# EAGLE schematic Dongle_charger (EAGLE 9.6.2)
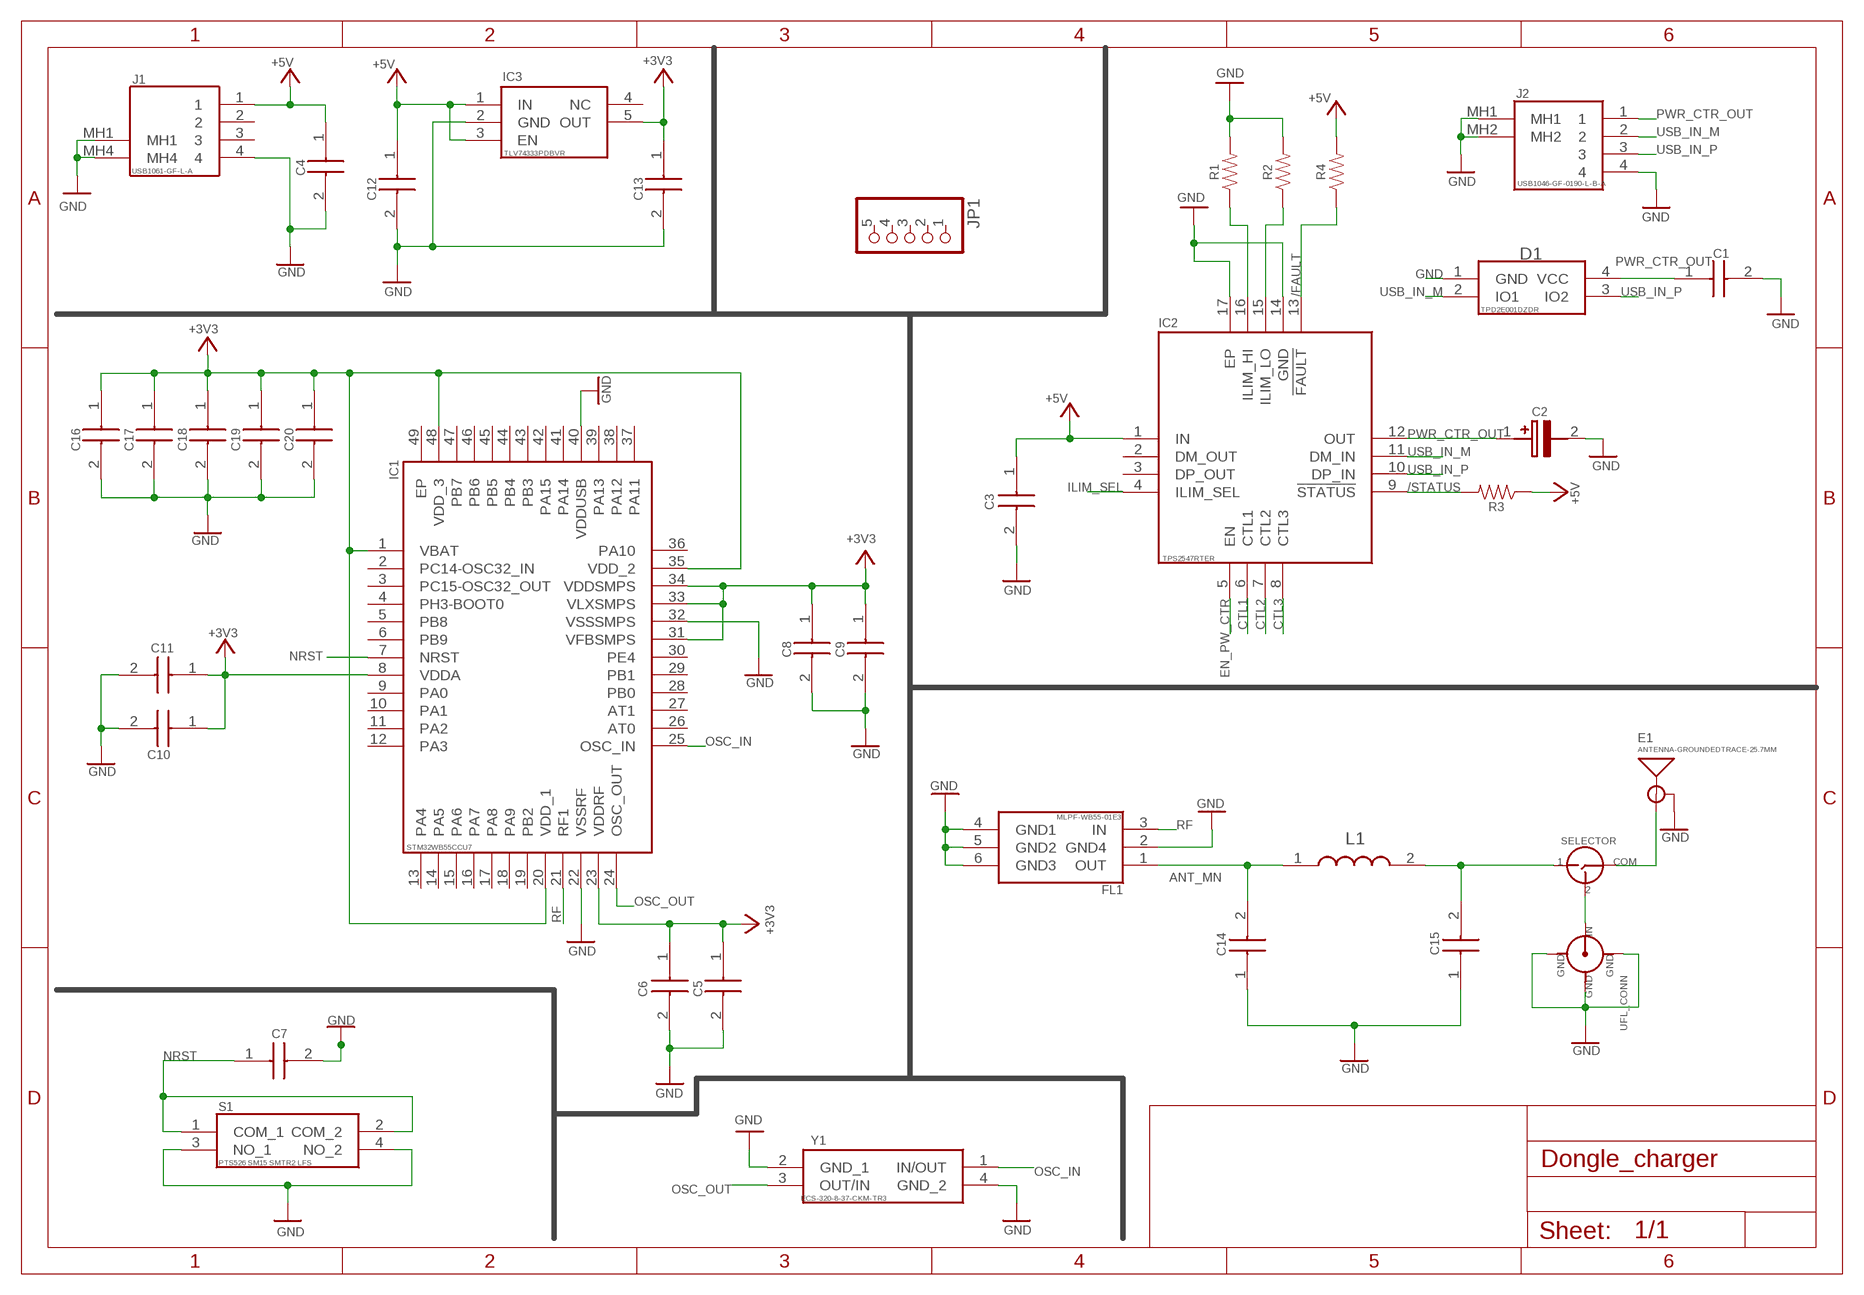
[diagram p0: schematic, sheet 1]

## Parts
C1  0.1u  C0603C104K5RAC7867  [CAPC1608X95N]
C2  150u  TPSD157K010R0100  [CAPPM7344X310N]
C3  0.1u  C0603C104K5RAC7867  [CAPC1608X95N]
C4  10u  CL21A106KOQNNNE  [CAPC2012X140N]
C5  100p  885012205055  [CAPC1005X55N]
C6  100n  LMF105B7104MVHF  [CAPPC1005X55N]
C7  C0603C104K5RAC7867  [CAPC1608X95N]
C8  4.7u  GRT188R6YA475KE13J  [CAPC1608X90N]
C9  0.1u  C0603C104K5RAC7867  [CAPC1608X95N]
C10  10n  C1608X5R1H103K080AA  [CAPC1608X80N]
C11  1u  CL10A105KA8NNNC  [CAPC1608X90N]
C12  1u  C0603C105K3PAC  [CAPC1608X95N]
C13  1u  C0603C105K3PAC  [CAPC1608X95N]
C14  GCM1555G1H1R0CA16D  [CAPC1005X55N]
C15  GCM1555G1H1R0CA16D  [CAPC1005X55N]
C16  4.7u  GRT188R6YA475KE13J  [CAPC1608X90N]
C17  0.1u  C0603C104K5RAC7867  [CAPC1608X95N]
C18  0.1u  C0603C104K5RAC7867  [CAPC1608X95N]
C19  0.1u  C0603C104K5RAC7867  [CAPC1608X95N]
C20  0.1u  C0603C104K5RAC7867  [CAPC1608X95N]
D1  TPD2E001DZDR  [TPD2E001DZDR]
E1  ANTENNA-GROUNDEDTRACE-25.7MM  [TRACE_ANTENNA_2.4GHZ_25.7MM]
FL1  MLPF-WB55-01E3  [MLPFWB5501E3]
IC1  STM32WB55CCU7  [QFN50P700X700X65-49N]
IC2  TPS2547RTER  [QFN50P300X300X80-17N]
IC3  TLV74333PDBVR  [SOT95P280X145-5N]
J1  USB1061-GF-L-A  [USB1061GFLA]
J2  USB1046-GF-0190-L-B-A  [USB1046GF0190LBA]
JP1  PINHD-1X5  [1X05]
L1  ATFC-0402-2N5-BT  [INDC1005X37N]
R1  16.9K  1.8MOHM  [0603]
R2  80.6K  1.8MOHM  [0603]
R3  80.6K  1.8MOHM  [0603]
R4  80.6K  1.8MOHM  [0603]
S1  PTS526_SM15_SMTR2_LFS  [PTS526SM15SMTR2LFS]
SEL1  3_PIN_RES  [3_PAD_RES]
UFL1  UFL_CONNECTOR  [UFL_CONNECTOR]
Y1  ECS-320-8-37-CKM-TR3  [ECS320837CKMTR3]

## Nets
+3V3: C5.1 C6.1(+) C8.1 C9.1 C10.1 C11.1 C13.1 C16.1 C17.1 C18.1 C19.1 C20.1 IC1.1(VBAT) IC1.8(VDDA) IC1.20(VDD_1) IC1.23(VDDRF) IC1.31(VFBSMPS) IC1.33(VLXSMPS) IC1.34(VDDSMPS) IC1.35(VDD_2) IC1.48(VDD_3) IC3.5(OUT)
+5V: C3.1 C4.1 C12.1 IC2.1(IN) IC3.1(IN) IC3.3(EN) J1.1 R3.1 R4.2
/FAULT: IC2.13(!FAULT) R4.1
/STATUS: IC2.9(!STATUS) R3.2
ANT_MN: C14.2 FL1.1(OUT) L1.1
CTL1: IC2.6(CTL1)
CTL2: IC2.7(CTL2)
CTL3: IC2.8(CTL3)
EN_PW_CTR: IC2.5(EN)
GND: C1.2 C2.2(-) C3.2 C4.2 C5.2 C6.2(-) C7.2 C8.2 C9.2 C10.2 C11.2 C12.2 C13.2 C14.1 C15.1 C16.2 C17.2 C18.2 C19.2 C20.2 D1.1(GND) E1.GND E1.GND2(GND) FL1.2(GND4) FL1.4(GND1) FL1.5(GND2) FL1.6(GND3) IC1.22(VSSRF) IC1.32(VSSSMPS) IC1.40(VDDUSB) IC2.14(GND) IC2.17(EP) IC3.2(GND) J1.4 J1.MH1 J1.MH4 J2.4 J2.MH1 J2.MH2 R1.2 R2.2 S1.3(NO_1) S1.4(NO_2) UFL1.1 UFL1.2 UFL1.3 Y1.2(GND_1) Y1.4(GND_2)
ILIM_SEL: IC2.4(ILIM_SEL)
N$1: E1.ANT(SIGNAL) SEL1.COM
N$2: C15.2 L1.2 SEL1.1
N$4: IC2.16(ILIM_HI) R1.1
N$5: IC2.15(ILIM_LO) R2.1
N$7: SEL1.2 UFL1.IN
NRST: C7.1 IC1.7(NRST) S1.1(COM_1) S1.2(COM_2)
OSC_IN: IC1.25(OSC_IN) Y1.1(IN/OUT)
OSC_OUT: IC1.24(OSC_OUT) Y1.3(OUT/IN)
PWR_CTR_OUT: C1.1 C2.1(+) D1.4(VCC) IC2.12(OUT) J2.1
RF: FL1.3(IN) IC1.21(RF1)
USB_IN_M: D1.2(IO1) IC2.11(DM_IN) J2.2
USB_IN_P: D1.3(IO2) IC2.10(DP_IN) J2.3
Unconnected: IC1.2(PC14-OSC32_IN) IC1.3(PC15-OSC32_OUT) IC1.4(PH3-BOOT0) IC1.5(PB8) IC1.6(PB9) IC1.9(PA0) IC1.10(PA1) IC1.11(PA2) IC1.12(PA3) IC1.13(PA4) IC1.14(PA5) IC1.15(PA6) IC1.16(PA7) IC1.17(PA8) IC1.18(PA9) IC1.19(PB2) IC1.26(AT0) IC1.27(AT1) IC1.28(PB0) IC1.29(PB1) IC1.30(PE4) IC1.36(PA10) IC1.37(PA11) IC1.38(PA12) IC1.39(PA13) IC1.41(PA14) IC1.42(PA15) IC1.43(PB3) IC1.44(PB4) IC1.45(PB5) IC1.46(PB6) IC1.47(PB7) IC1.49(EP) IC2.2(DM_OUT) IC2.3(DP_OUT) IC3.4(NC) J1.2 J1.3 JP1.1 JP1.2 JP1.3 JP1.4 JP1.5

## Library data of the parts
C1 C3 C7 C9 C17-C20 = SamacSys_Parts:C0603C104K5RAC7867: Multilayer Ceramic Capacitors MLCC - SMD/SMT 50V 0.1uF X7R 0603 10% Source: Datasheet <https://www.kemet.com/specsheet/C0603C104K5RACTUhttps://www.kemet.com/specsheet/C0603C104K5RACTU>; DESCRIPTION: Multilayer Ceramic Capacitors MLCC - SMD/SMT 50V 0.1uF X7R 0603 10%; HEIGHT: 0.95mm; MANUFACTURER_NAME: KEMET; MANUFACTURER_PART_NUMBER: C0603C104K5RAC7867; MOUSER_PART_NUMBER: 80-C0603C104K5R7867; MOUSER_PRICE-STOCK: https://www.mouser.co.uk/ProductDetail/KEMET/C0603C104K5RAC7867?qs=xVzHhAug4FAw3onBjqyf%252BQ%3D%3D
C2 = SamacSys_Parts:TPSD157K010R0100: AVX - TPSD157K010R0100 - Surface Mount Tantalum Capacitor, 150 F, 10 V, 2917 [7343 Metric], TPS Series, +/- 10%, -55 C Source: Datasheet <https://componentsearchengine.com/Datasheets/2/TPSD157K010R0100.pdf>; DESCRIPTION: AVX - TPSD157K010R0100 - Surface Mount Tantalum Capacitor, 150 F, 10 V, 2917 [7343 Metric], TPS Series, +/- 10%, -55 C; HEIGHT: 3.1mm; MANUFACTURER_NAME: AVX; MANUFACTURER_PART_NUMBER: TPSD157K010R0100
C4 = SamacSys_Parts:CL21A106KOQNNNE: Samsung Electro-Mechanics 0805 (2012M) 10uF MLCC 16V dc +/-10% SMD CL21A106KOQNNNE Source: Datasheet <https://datasheet.datasheetarchive.com/originals/distributors/Datasheets_SAMA/0289c6d4f30f89b64e7dd5b6a9ee99f0.pdf>; DESCRIPTION: Samsung Electro-Mechanics 0805 (2012M) 10uF MLCC 16V dc +/-10% SMD CL21A106KOQNNNE; HEIGHT: 1.4mm; MANUFACTURER_NAME: SAMSUNG; MANUFACTURER_PART_NUMBER: CL21A106KOQNNNE; MOUSER_PART_NUMBER: 187-CL21A106KOQNNNE; MOUSER_PRICE-STOCK: https://www.mouser.co.uk/ProductDetail/Samsung-Electro-Mechanics/CL21A106KOQNNNE?qs=349EhDEZ59qKIX0T0PKtPw%3D%3D
C5 = SamacSys_Parts:885012205055: Wurth Elektronik 0402 WCAP-CSGP 100pF Ceramic Multilayer Capacitor, 50 V dc, +125C, X7R Dielectric, +/-10% Source: Datasheet; DESCRIPTION: Wurth Elektronik 0402 WCAP-CSGP 100pF Ceramic Multilayer Capacitor, 50 V dc, +125C, X7R Dielectric, +/-10%; HEIGHT: 0.55mm; MANUFACTURER_NAME: Wurth Elektronik; MANUFACTURER_PART_NUMBER: 885012205055; MOUSER_PART_NUMBER: 710-885012205055; MOUSER_PRICE-STOCK: https://www.mouser.co.uk/ProductDetail/Wurth-Elektronik/885012205055?qs=0KOYDY2FL2%2Fx3DGu8EcJew%3D%3D
C6 = SamacSys_Parts:LMF105B7104MVHF: Multilayer Ceramic Capacitors MLCC - SMD/SMT 0402 10V 0.1uF 20% AEC-Q200 Source: Datasheet <https://componentsearchengine.com/Datasheets/1/LMF105B7104MVHF.pdf>; DESCRIPTION: Multilayer Ceramic Capacitors MLCC - SMD/SMT 0402 10V 0.1uF 20% AEC-Q200; HEIGHT: 0.55mm; MANUFACTURER_NAME: TAIYO YUDEN; MANUFACTURER_PART_NUMBER: LMF105B7104MVHF; MOUSER_PART_NUMBER: 963-LMF105B7104MVHF; MOUSER_PRICE-STOCK: https://www.mouser.co.uk/ProductDetail/Taiyo-Yuden/LMF105B7104MVHF?qs=%252B6g0mu59x7KGy1rQfautGg%3D%3D
C8 C16 = SamacSys_Parts:GRT188R6YA475KE13J: Capacitor GRT18 L=1.6mm W=0.8mm T=0.8mm 4.7uF 35VDC Source: Datasheet <https://psearch.en.murata.com/capacitor/product/GRT188R6YA475KE13#.html>; DESCRIPTION: Capacitor GRT18 L=1.6mm W=0.8mm T=0.8mm; HEIGHT: 0.9mm; MANUFACTURER_NAME: Murata Electronics; MANUFACTURER_PART_NUMBER: GRT188R6YA475KE13J; MOUSER_PART_NUMBER: 81-GRT188R6YA475KE3J; MOUSER_PRICE-STOCK: https://www.mouser.co.uk/ProductDetail/Murata-Electronics/GRT188R6YA475KE13J?qs=d0WKAl%252BL4Kb75CCCaGtx8w%3D%3D
C10 = SamacSys_Parts:C1608X5R1H103K080AA: MULTILAYER CERAMIC CHIP CAPACITORS, 1608, Commercial grade, general (Up to 75V) Source: Datasheet <https://componentsearchengine.com/Datasheets/1/C1608X5R1H103K080AA.pdf>; DESCRIPTION: MULTILAYER CERAMIC CHIP CAPACITORS, 1608, Commercial grade, general (Up to 75V); HEIGHT: 0.8mm; MANUFACTURER_NAME: TDK; MANUFACTURER_PART_NUMBER: C1608X5R1H103K080AA; MOUSER_PART_NUMBER: 810-C1608X5R1H103KAA; MOUSER_PRICE-STOCK: https://www.mouser.com/Search/Refine.aspx?Keyword=810-C1608X5R1H103KAA
C11 = SamacSys_Parts:CL10A105KA8NNNC: Samsung Electro-Mechanics 0603 CL 1uF Ceramic Multilayer Capacitor, 25 V, +85C, X5R Dielectric, +/-10% SMD Source: Datasheet; DESCRIPTION: Samsung Electro-Mechanics 0603 CL 1uF Ceramic Multilayer Capacitor, 25 V, +85C, X5R Dielectric, +/-10% SMD; HEIGHT: 0.9mm; MANUFACTURER_NAME: SAMSUNG; MANUFACTURER_PART_NUMBER: CL10A105KA8NNNC; MOUSER_PART_NUMBER: 187-CL10A105KA8NNNC; MOUSER_PRICE-STOCK: https://www.mouser.co.uk/ProductDetail/Samsung-Electro-Mechanics/CL10A105KA8NNNC?qs=hqM3L16%252BxldY%252BnK4KzDJVg%3D%3D
C12 C13 = SamacSys_Parts:C0603C105K3PAC: Multilayer Ceramic Capacitors MLCC - SMD/SMT 1uF 25V X5R 10% Source: Datasheet <https://www.kemet.com/specsheet/C0603C105K3PACTU>; DESCRIPTION: Multilayer Ceramic Capacitors MLCC - SMD/SMT 1uF 25V X5R 10%; HEIGHT: 0.95mm; MANUFACTURER_NAME: KEMET; MANUFACTURER_PART_NUMBER: C0603C105K3PAC; MOUSER_PART_NUMBER: 80-C0603C105K3PAC; MOUSER_PRICE-STOCK: https://www.mouser.co.uk/ProductDetail/KEMET/C0603C105K3PAC?qs=Zh2ruSKDRuDYcd11xelchg%3D%3D
C14 C15 = SamacSys_Parts:GCM1555G1H1R0CA16D: Capacitor GCM15 L=1.0mm W=0.5mm T=0.5mm Source: Datasheet <https://componentsearchengine.com/Datasheets/1/GCM1555G1H1R0CA16D.pdf>; DESCRIPTION: Capacitor GCM15 L=1.0mm W=0.5mm T=0.5mm; HEIGHT: 0.55mm; MANUFACTURER_NAME: Murata Electronics; MANUFACTURER_PART_NUMBER: GCM1555G1H1R0CA16D; MOUSER_PART_NUMBER: 81-GCM1555G1H1R0CA6D; MOUSER_PRICE-STOCK: https://www.mouser.com/Search/Refine.aspx?Keyword=81-GCM1555G1H1R0CA6D
D1 = SamacSys_Parts:TPD2E001DZDR: Low-Capacitance 2-Channel +/-15kV ESD Protection Array for High-Speed Data Interfaces Source: Datasheet <http://www.ti.com/lit/gpn/tpd2e001>; DESCRIPTION: Low-Capacitance 2-Channel +/-15kV ESD Protection Array for High-Speed Data Interfaces; HEIGHT: 1mm; MANUFACTURER_NAME: Texas Instruments; MANUFACTURER_PART_NUMBER: TPD2E001DZDR; MOUSER_PART_NUMBER: 595-TPD2E001DZDR; MOUSER_PRICE-STOCK: https://www.mouser.co.uk/ProductDetail/Texas-Instruments/TPD2E001DZDR?qs=6kmNHVaEmPhk6KdNbOe6jw%3D%3D
E1 = SparkFun-RF:ANTENNA-GROUNDED: Antenna w/ Ground Connection 2.4GHz antennae with signal and ground terminals. TRACE_ANTENNA_2.4GHZ_15.2MM - Meander Trace antenna 15.2 x 5.7mm footprint Based on layout from TI app note AN043 <http://www.ti.com/lit/an/swra117d/swra117d.pdf>. TRACE_ANTENNA_2.4GHZ_25.7MM - Inverted F trace antenna 25.7 x 7.5 mm footprint. Based on layout from TI design note DN0007 <http://www.ti.com/lit/an/swru120b/swru120b.pdf>.
FL1 = SamacSys_Parts:MLPF-WB55-01E3: RF Wireless Misc 2.4 GHz Low Pass Filter matched to STM32WB55 Source: Datasheet <https://www.st.com/resource/en/datasheet/mlpf-wb55-01e3.pdf>; DESCRIPTION: RF Wireless Misc 2.4 GHz Low Pass Filter matched to STM32WB55; HEIGHT: 0.7mm; MANUFACTURER_NAME: STMicroelectronics; MANUFACTURER_PART_NUMBER: MLPF-WB55-01E3; MOUSER_PART_NUMBER: 511-MLPF-WB55-01E3; MOUSER_PRICE-STOCK: https://www.mouser.co.uk/ProductDetail/STMicroelectronics/MLPF-WB55-01E3?qs=vLWxofP3U2xV%2FkxL9PmCDA%3D%3D
IC1 = SamacSys_Parts:STM32WB55CCU7: Bluetooth v5.0 and 802.15.4 With Microcontroller Combo module Source: Datasheet <https://www.st.com/resource/en/datasheet/stm32wb55cc.pdf>; DESCRIPTION: Bluetooth v5.0 and 802.15.4 With Microcontroller Combo module; HEIGHT: 0.65mm; MANUFACTURER_NAME: STMicroelectronics; MANUFACTURER_PART_NUMBER: STM32WB55CCU7; MOUSER_PART_NUMBER: 511-STM32WB55CCU7; MOUSER_PRICE-STOCK: https://www.mouser.co.uk/ProductDetail/STMicroelectronics/STM32WB55CCU7?qs=vLWxofP3U2xRYbJEMRtKWA%3D%3D; SPICEPREFIX: X
IC2 = SamacSys_Parts:TPS2547RTER: USB Charging Port Controller and 3A Power Switch With Load Detection Source: Datasheet <http://www.ti.com/lit/gpn/tps2547>; ARROW_PART_NUMBER: TPS2547RTER; ARROW_PRICE-STOCK: https://www.arrow.com/en/products/tps2547rter/texas-instruments; DESCRIPTION: USB Charging Port Controller and 3A Power Switch With Load Detection; HEIGHT: 0.8mm; MANUFACTURER_NAME: Texas Instruments; MANUFACTURER_PART_NUMBER: TPS2547RTER; MOUSER_PART_NUMBER: 595-TPS2547RTER; MOUSER_PRICE-STOCK: https://www.mouser.com/Search/Refine.aspx?Keyword=595-TPS2547RTER
IC3 = SamacSys_Parts:TLV74333PDBVR: 300mA Low-Dropout (LDO) Regulator Source: Datasheet <http://www.ti.com/lit/gpn/tlv743p>; DESCRIPTION: 300mA Low-Dropout (LDO) Regulator; HEIGHT: 1.45mm; MANUFACTURER_NAME: Texas Instruments; MANUFACTURER_PART_NUMBER: TLV74333PDBVR; MOUSER_PART_NUMBER: 595-TLV74333PDBVR; MOUSER_PRICE-STOCK: https://www.mouser.co.uk/ProductDetail/Texas-Instruments/TLV74333PDBVR?qs=EU6FO9ffTwe08kePOwcQGA%3D%3D
J1 = SamacSys_Parts:USB1061-GF-L-A: USB Connectors USB A Plug, SMT, R/A, GF, With Kinked shell stakes and posts, T&R Source: Datasheet <https://gct.co/connector/usb1061>; DESCRIPTION: USB Connectors USB A Plug, SMT, R/A, GF, With Kinked shell stakes and posts, T&R; HEIGHT: 4.6mm; MANUFACTURER_NAME: GCT (GLOBAL CONNECTOR TECHNOLOGY); MANUFACTURER_PART_NUMBER: USB1061-GF-L-A; MOUSER_PART_NUMBER: 640-USB1061-GF-L-A; MOUSER_PRICE-STOCK: https://www.mouser.co.uk/ProductDetail/GCT/USB1061-GF-L-A?qs=KUoIvG%2F9IlYSthVIrIBVzQ%3D%3D
J2 = SamacSys_Parts:USB1046-GF-0190-L-B-A: USB Connectors USB A Skt, Top Mount, SMT, R/A, GF, Black, With 1.9mm shell stake, T&R Source: Datasheet <https://gct.co/files/drawings/usb1046.pdf?v=ccb5d20d-0631-4297-aa3c-9c34fccf9fbc>; DESCRIPTION: USB Connectors USB A Skt, Top Mount, SMT, R/A, GF, Black, With 1.9mm shell stake, T&R; HEIGHT: 7.2mm; MANUFACTURER_NAME: GCT (GLOBAL CONNECTOR TECHNOLOGY); MANUFACTURER_PART_NUMBER: USB1046-GF-0190-L-B-A; MOUSER_PART_NUMBER: 640-USB1046GF0190LBA; MOUSER_PRICE-STOCK: https://www.mouser.co.uk/ProductDetail/GCT/USB1046-GF-0190-L-B-A?qs=KUoIvG%2F9IlbZOJtEsn1unA%3D%3D
JP1 = pinhead:PINHD-1X5: PIN HEADER
L1 = SamacSys_Parts:ATFC-0402-2N5-BT: Fixed Inductors 2.5uH +/-0.1nH Source: Datasheet <https://componentsearchengine.com/Datasheets/1/ATFC-0402-2N5-BT.pdf>; DESCRIPTION: Fixed Inductors 2.5uH +/-0.1nH; HEIGHT: 0.37mm; MANUFACTURER_NAME: ABRACON; MANUFACTURER_PART_NUMBER: ATFC-0402-2N5-BT; MOUSER_PART_NUMBER: 815-ATFC-0402-2N5-BT; MOUSER_PRICE-STOCK: https://www.mouser.com/Search/Refine.aspx?Keyword=815-ATFC-0402-2N5-BT
R1-R4 = SparkFun-Resistors:1.8MOHM: 1.8 MOhms ±5% 0.1W, 1/10W Chip Resistor 0603; PROD_ID: RES-13994; VALUE: 1.8M
S1 = SamacSys_Parts:PTS526_SM15_SMTR2_LFS: Tactile Switches 50mA 12VDC, 5.2x5.2mm, 1.5mm H, 160gf, G leads, No ground pin, metal actuator Source: Datasheet; DESCRIPTION: Tactile Switches 50mA 12VDC, 5.2x5.2mm, 1.5mm H, 160gf, G leads, No ground pin, metal actuator; HEIGHT: 1.5mm; MANUFACTURER_NAME: C & K COMPONENTS; MANUFACTURER_PART_NUMBER: PTS526 SM15 SMTR2 LFS; MOUSER_PART_NUMBER: 611-PTS526SM15SMTR2L; MOUSER_PRICE-STOCK: https://www.mouser.co.uk/ProductDetail/CK/PTS526-SM15-SMTR2-LFS?qs=UXgszm6BlbENivbslIA%252B5g%3D%3D
SEL1 = Personal_Lib:3_PIN_RES
UFL1 = Personal_Lib:UFL_CONNECTOR
Y1 = SamacSys_Parts:ECS-320-8-37-CKM-TR3: Crystals 32.000 MHz, CL 8 pF TOL +/-10 ppm, STAB +/-10 ppm, -20 +70 C ECX-1637 2.0x1.6 mm ESR 60O RoHS Source: Datasheet; DESCRIPTION: Crystals 32.000 MHz, CL 8 pF TOL +/-10 ppm, STAB +/-10 ppm, -20 +70 C ECX-1637 2.0x1.6 mm ESR 60O RoHS; HEIGHT: 0.55mm; MANUFACTURER_NAME: ECS; MANUFACTURER_PART_NUMBER: ECS-320-8-37-CKM-TR3; MOUSER_PART_NUMBER: 520-ECS-320837CKMTR3; MOUSER_PRICE-STOCK: https://www.mouser.co.uk/ProductDetail/ECS/ECS-320-8-37-CKM-TR3?qs=Wj%2FVkw3K%252BMA6yOTc3kdDxg%3D%3D